# Altium schematic sheet Top_Schematic_Sheet.SchDoc: H201 Monitor Board Block Diagram
size A4; DocumentNumber: 1; SheetNumber: 1; SheetTotal: 31
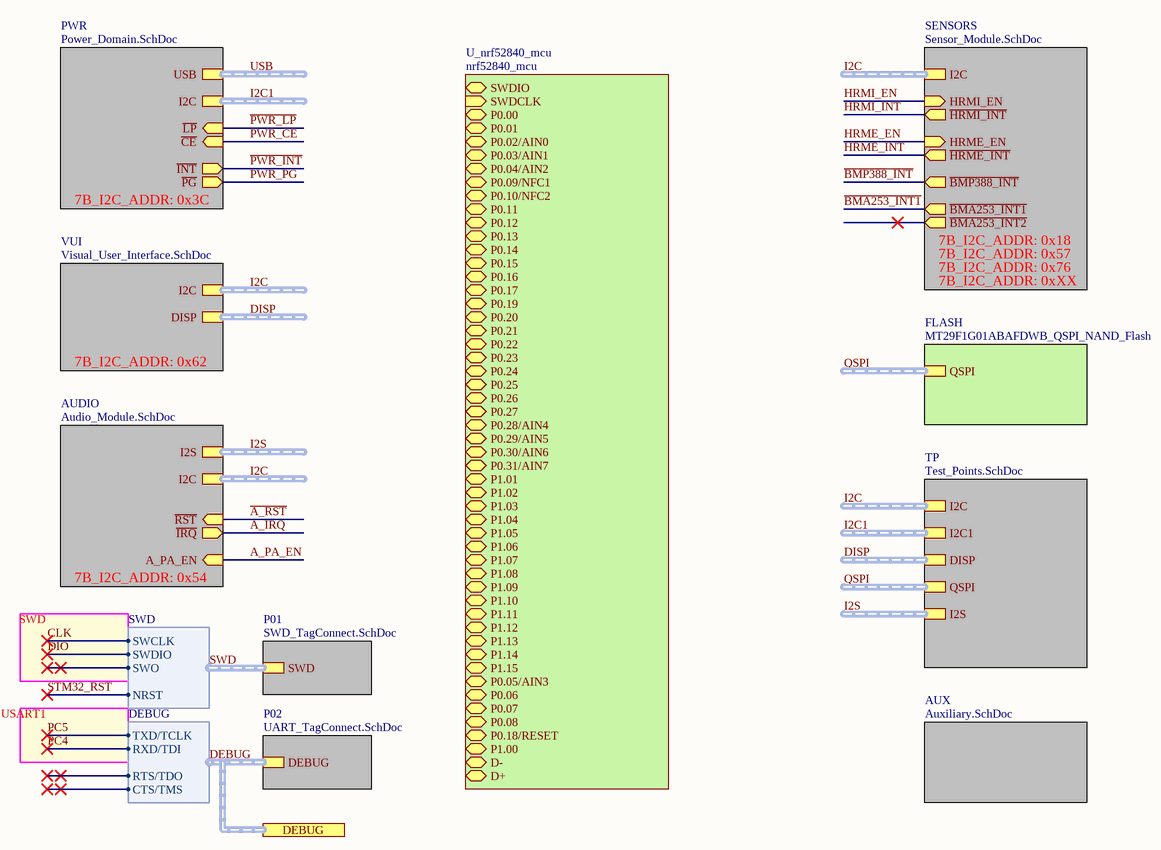
[diagram p0: Top_Schematic_Sheet.SchDoc]

## Sub-sheets
AUDIO = Audio_Module.SchDoc: I2S (harness I2S), I2C (harness I2C), ~{RST} (in), ~{IRQ} (out), A_PA_EN (in)  | 7B_I2C_ADDR: 0x54
AUX = Auxiliary.SchDoc: no entries
FLASH = MT29F1G01ABAFDWB_QSPI_NAND_Flash: QSPI (harness QSPI)
P01 = SWD_TagConnect.SchDoc: SWD (harness SWD)  | Caption: SWD
P02 = UART_TagConnect.SchDoc: DEBUG (harness DEBUG)  | Caption: DEBUG
PWR = Power_Domain.SchDoc: USB (harness USB), I2C (harness I2C), ~{LP} (in), ~{PG} (out), ~{INT} (out), ~{CE} (in)  | 7B_I2C_ADDR: 0x3C
SENSORS = Sensor_Module.SchDoc: I2C (harness I2C), ~{BMA253_INT1} (out), ~{BMP388_INT} (out), ~{BMA253_INT2} (out), ~{HRMI_INT} (out), ~{HRME_INT} (out), HRMI_EN (in), HRME_EN (in)  | 7B_I2C_ADDR: 0x57; 7B_I2C_ADDR: 0x18; 7B_I2C_ADDR: 0x76; 7B_I2C_ADDR: 0xXX
TP = Test_Points.SchDoc: I2C (harness I2C), DISP (harness DISP_SPI), QSPI (harness QSPI), I2S (harness I2S), I2C1 (harness I2C)
U_nrf52840_mcu = nrf52840_mcu: SWDIO (bidir), SWDCLK (in), P0.00 (bidir), P0.01 (bidir), P0.02/AIN0 (bidir), P0.03/AIN1 (bidir), P0.04/AIN2 (bidir), P0.09/NFC1 (bidir), P0.10/NFC2 (bidir), P0.11 (bidir), P0.12 (bidir), P0.13 (bidir), P0.14 (bidir), P0.15 (bidir), P0.16 (bidir), P0.17 (bidir), P0.19 (bidir), P0.20 (bidir), P0.21 (bidir), P0.22 (bidir), P0.23 (bidir), P0.24 (bidir), P0.25 (bidir), P0.26 (bidir), P0.27 (bidir), P0.28/AIN4 (bidir), P0.29/AIN5 (bidir), P0.30/AIN6 (bidir), P0.31/AIN7 (bidir), P1.01 (bidir), P1.02 (bidir), P1.03 (bidir), P1.04 (bidir), P1.05 (bidir), P1.06 (bidir), P1.07 (bidir), P1.08 (bidir), P1.09 (bidir), P1.10 (bidir), P1.11 (bidir), P1.12 (bidir), P1.13 (bidir), P1.14 (bidir), P1.15 (bidir), P0.05/AIN3 (bidir), P0.06 (bidir), P0.07 (bidir), P0.08 (bidir), P0.18/RESET (bidir), P1.00 (bidir), D- (bidir), D+ (bidir)
VUI = Visual_User_Interface.SchDoc: I2C (harness I2C), DISP (harness DISP_SPI)  | 7B_I2C_ADDR: 0x62

## Ports
DEBUG (harness DEBUG)

## Harnesses
SWD: SWDIO, SWCLK, NRST, SWO
DEBUG: TXD/TCLK, RXD/TDI, RTS/TDO, CTS/TMS

## Nets
~{A_IRQ}: sheet AUDIO/~{IRQ}
~{A_RST}: sheet AUDIO/~{RST}
~{BMA253_INT1}: sheet SENSORS/~{BMA253_INT1}
~{BMP388_INT}: sheet SENSORS/~{BMP388_INT}
~{HRME_INT}: sheet SENSORS/~{HRME_INT}
~{HRMI_INT}: sheet SENSORS/~{HRMI_INT}
~{PWR_CE}: sheet PWR/~{CE}
~{PWR_INT}: sheet PWR/~{INT}
~{PWR_LP}: sheet PWR/~{LP}
~{PWR_PG}: sheet PWR/~{PG}
~{STM32_RST}: sheet P01/SWD.NRST
A_PA_EN: sheet AUDIO/A_PA_EN
CLK: sheet P01/SWD.SWCLK
DIO: sheet P01/SWD.SWDIO
HRME_EN: sheet SENSORS/HRME_EN
HRMI_EN: sheet SENSORS/HRMI_EN
PC4: port DEBUG.RXD/TDI  [project net DEBUG.RXD/TDI]
PC5: port DEBUG.TXD/TCLK  [project net DEBUG.TXD/TCLK]

## Buses and harness runs
harness DEBUG = port DEBUG = sheet P02/DEBUG
harness DISP = sheet TP/DISP
harness DISP = sheet VUI/DISP
harness I2C1 = sheet PWR/I2C
harness I2C1 = sheet TP/I2C1
harness I2C = sheet AUDIO/I2C
harness I2C = sheet SENSORS/I2C
harness I2C = sheet TP/I2C
harness I2C = sheet VUI/I2C
harness I2S = sheet AUDIO/I2S
harness I2S = sheet TP/I2S
harness QSPI = sheet FLASH/QSPI
harness QSPI = sheet TP/QSPI
harness SWD = sheet P01/SWD
harness USB = sheet PWR/USB

## Notes on the sheet
- SWD
- USART1
- Title
- Size:
- Date:
- A4
- Number:
- Time:
- Revision:
- Sheet
- of
- File: